# Altium schematic sheet [3] Latch-Connector_Stage.SchDoc
size A2
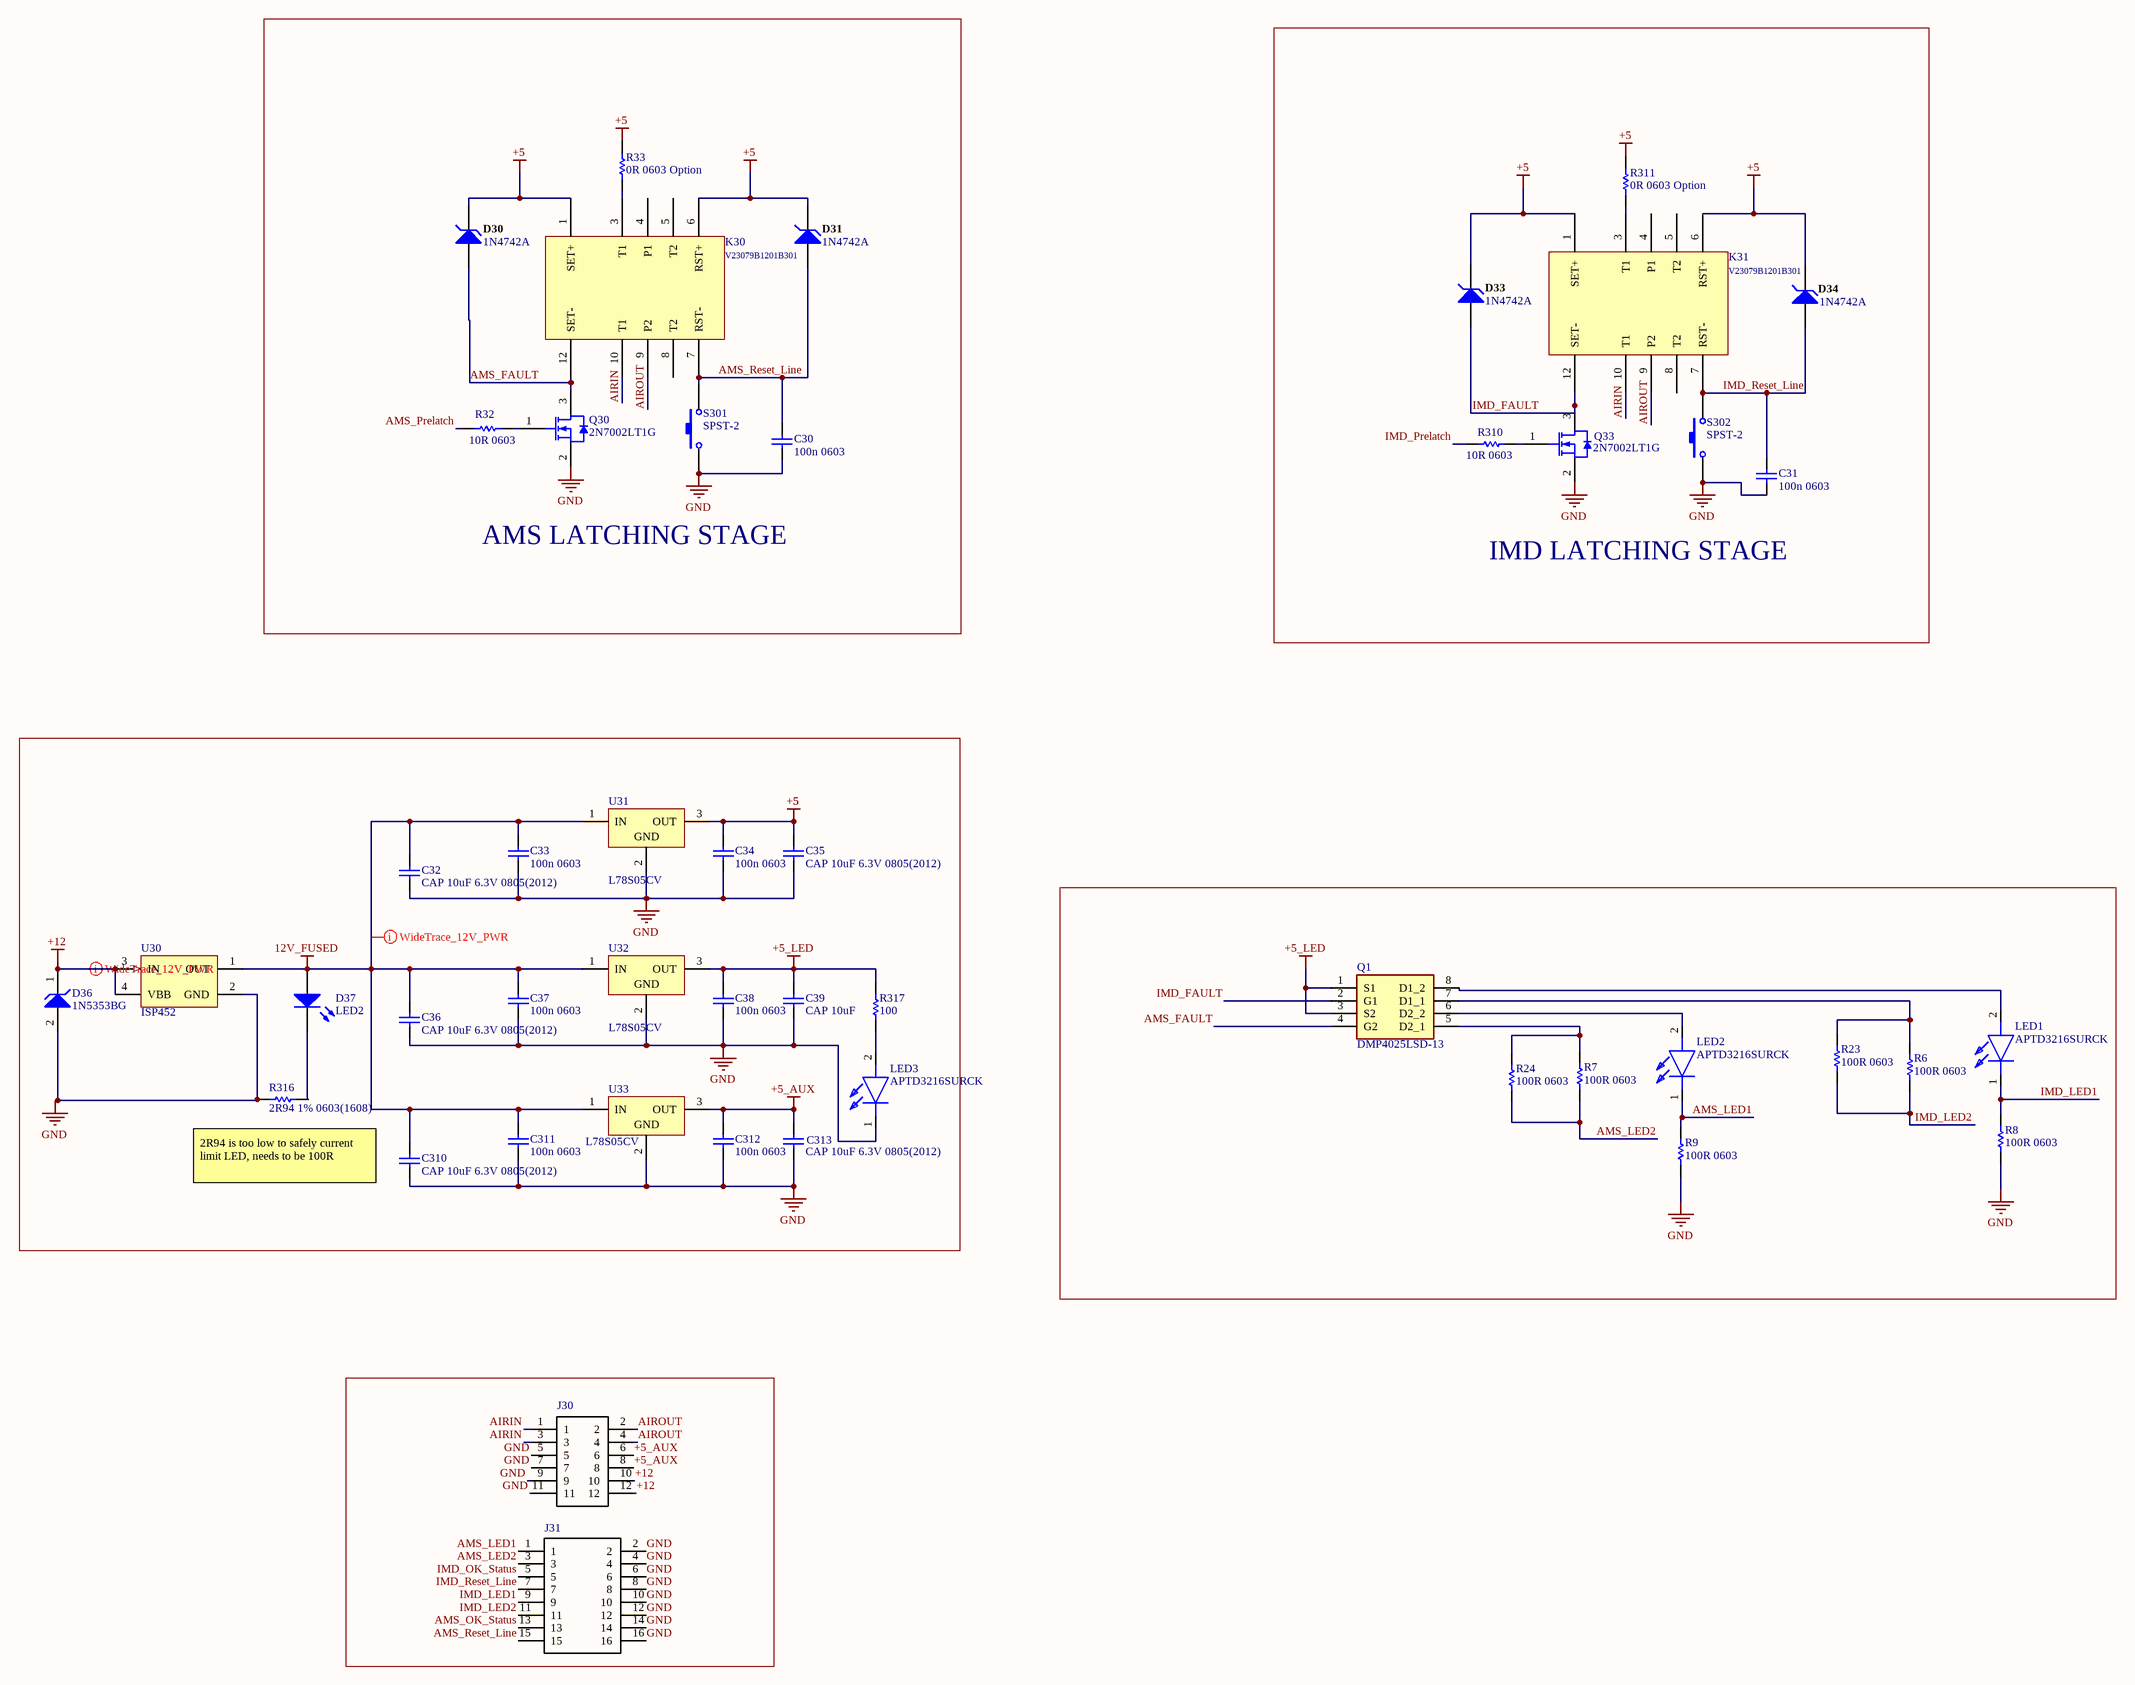
[diagram p0: [3] Latch-Connector_Stage.SchDoc]

## Parts
C30  100n 0603  [CAPC0603(1608)100_M]
C31  100n 0603  [CAPC0603(1608)100_M]
C32  CAP 10uF 6.3V 0805(2012)  [CAPC0805(2012)145_L]
C33  100n 0603  [CAPC0603(1608)100_M]
C34  100n 0603  [CAPC0603(1608)100_M]
C35  CAP 10uF 6.3V 0805(2012)  [CAPC0805(2012)145_L]
C36  CAP 10uF 6.3V 0805(2012)  [CAPC0805(2012)145_L]
C37  100n 0603  [CAPC0603(1608)100_M]
C38  100n 0603  [CAPC0603(1608)100_M]
C39  CAP 10uF  [CAPC0805(2012)145_L]
C310  CAP 10uF 6.3V 0805(2012)  [CAPC0805(2012)145_L]
C311  100n 0603  [CAPC0603(1608)100_M]
C312  100n 0603  [CAPC0603(1608)100_M]
C313  CAP 10uF 6.3V 0805(2012)  [CAPC0805(2012)145_L]
D30  1N4742A  [FAIR-DO-41-2_V]
D31  1N4742A  [FAIR-DO-41-2_V]
D33  1N4742A  [FAIR-DO-41-2_V]
D34  1N4742A  [FAIR-DO-41-2_V]
D36  1N5353BG  [ONSC-SURMETIC40-2-017AA-01]
D37  LED2  [3.2X1.6X1.1]
J30  4-794618-2  [*TE_4-794618-2]  (value not drawn)
J31  4-794618-6  [*TE_4-794618-6]  (value not drawn)
K30  V23079B1201B301  [V23079B1201B301 DPDT]
K31  V23079B1201B301  [V23079B1201B301 DPDT]
LED1  APTD3216SURCK  [LEDC3216X200N]
LED2  APTD3216SURCK  [LEDC3216X200N]
LED3  APTD3216SURCK  [LEDC3216X200N]
Q1  DMP4025LSD-13  [SOIC127P600X175-8N]
Q30  2N7002LT1G  [ONSC-SOT-23-3-318-08_V]
Q33  2N7002LT1G  [ONSC-SOT-23-3-318-08_V]
R6  100R 0603  [RESC1609X50X30ML8T20]
R7  100R 0603  [RESC1609X50X30ML8T20]
R8  100R 0603  [RESC1609X50X30ML8T20]
R9  100R 0603  [RESC1609X50X30ML8T20]
R23  100R 0603  [RESC1609X50X30ML8T20]
R24  100R 0603  [RESC1609X50X30ML8T20]
R32  10R 0603  [CAPC0603(1608)100_M]
R33  0R 0603 Option  [CAPC0603(1608)100_M]
R310  10R 0603  [CAPC0603(1608)100_M]
R311  0R 0603 Option  [CAPC0603(1608)100_M]
R316  2R94 1% 0603(1608)  [RESC0603(1608)_L]
R317  100  [RESC0603(1608)_L]
S301  SPST-2  [SPST-2]
S302  SPST-2  [SPST-2]
U30  ISP452  [INF-SOT223_L]
U31  L78S05CV  [TO220]
U32  L78S05CV  [TO220]
U33  L78S05CV  [TO220]

## Blocks framed on the sheet
AMS LATCHING STAGE: C30 D30 D31 K30 Q30 R32 R33 S301
IMD LATCHING STAGE: C31 D33 D34 K31 Q33 R310 R311 S302

## Nets
12V_FUSED: C32.2 C33.2 C36.2 C37.2 C310.2 C311.2 D37.1(A) U30.1(OUT) U31.1(IN) U32.1(IN) U33.1(IN)
+5: C34.2 C35.2 D30.2(K) D31.2(K) D33.2(K) D34.2(K) K30.1(SET+) K30.6(RST+) K31.1(SET+) K31.6(RST+) R33.2 R311.2 U31.3(OUT)
+5_AUX: C312.2 C313.2 J30.6 J30.8 U33.3(OUT)
+5_LED: C38.2 C39.2 Q1.1(S1) Q1.3(S2) R317.2 U32.3(OUT)
+12: D36.1(K) J30.10 J30.12 U30.3(IN) U30.4(VBB)
GND: C30.1 C31.1 C32.1 C33.1 C34.1 C35.1 C36.1 C37.1 C38.1 C39.1 C310.1 C311.1 C312.1 C313.1 D36.2(A) J30.5 J30.7 J30.9 J30.11 J31.2 J31.4 J31.6 J31.8 J31.10 J31.12 J31.14 J31.16 LED3.1(K) Q30.2(S) Q33.2(S) R8.1 R9.1 R316.1 S301.1 S302.1 U30.2(GND) U31.2(GND) U32.2(GND) U33.2(GND)
AIRIN: J30.1 J30.3 K30.10(T1) K31.10(T1)
AIROUT: J30.2 J30.4 K30.9(P2) K31.9(P2)
AMS_FAULT: D30.1(A) K30.12(SET-) Q1.4(G2) Q30.3(D)
AMS_LED1: J31.1 LED2.1(K) R9.2
AMS_LED2: J31.3 R7.1 R24.1
AMS_OK_Status: J31.13
AMS_Prelatch: R32.1
AMS_Reset_Line: C30.2 D31.1(A) J31.15 K30.7(RST-) S301.2
IMD_FAULT: D33.1(A) K31.12(SET-) Q1.2(G1) Q33.3(D)
IMD_LED1: J31.9 LED1.1(K) R8.2
IMD_LED2: J31.11 R6.1 R23.1
IMD_OK_Status: J31.5
IMD_Prelatch: R310.1
IMD_Reset_Line: C31.2 D34.1(A) J31.7 K31.7(RST-) S302.2
NetD37_2: D37.2(K) R316.2
NetK30_3: K30.3(T1) R33.1
NetK31_3: K31.3(T1) R311.1
NetLED1_2: LED1.2(A) Q1.8(D1_2)
NetLED2_2: LED2.2(A) Q1.6(D2_2)
NetLED3_2: LED3.2(A) R317.1
NetQ1_5: Q1.5(D2_1) R7.2 R24.2
NetQ1_7: Q1.7(D1_1) R6.2 R23.2
NetQ30_1: Q30.1(G) R32.2
NetQ33_1: Q33.1(G) R310.2

Not connected (* = marked no-connect by the designer): K30 4(P1) 5(T2) 8(T2); K31 4(P1) 5(T2) 8(T2)

## Layout directives
rule Width Constraint [Pref Width = 78.74mil    Min Width = 78.74mil    Max Width = 78.74mil]: +12
rule Width Constraint [Pref Width = 150mil    Min Width = 150mil    Max Width = 150mil]: 12V_FUSED

## Notes on the sheet
- 2R94 is too low to safely current limit LED, needs to be 100R

## Library data of the parts
C30 C31 C33 C34 C37 C38 C311 C312 = CAP: Parameter 1: 100n
C32 C35 C36 C39 C310 C313 = CMP-1036-04915-1: CAP 10uF 6.3V ±10% 0805 (2012 Metric) Thickness 1.45mm SMD; Tolerance: Â±10%; Case-EIA: 0805; Case-Metric: 2012; Technology: SMT; Rated Voltage: 6.3 V; Value: 10uF; Max Thickness: 1.45 mm
D30 D31 D33 D34 = CMP-0892-00001-1: Zener Diode, 12V, 1W, 5%, -65 to 200 degC, 2-Pin DO-41, Body 2.72 x 5.2 mm, RoHS; Manufacturer: Fairchild Semiconductor; PD (W): 1; VZ (Min.) (V): 11.4; VZ (Max.) (V): 12.6; ZZ (Max) (ohm): 8; IR (uA): 5; Test Current IZ (mA): 21; PartNumber: 1N4742A; PackageVersion: Rev. 2; DatasheetVersion: Rev. H3; Mounting Technology: Through Hole; Tolerance: 5%; PackageDescription: 2-Pin Axial leaded, Body 2.72 x 5.2 mm, Lead Spread 25.4 mm; ComponentLink1Description: Manufacturer URL; ComponentLink3Description: Package Specification; ComponentLink2Description: Datasheet; ComponentLink2URL: http://www.fairchildsemi.com/ds/1N/1N4744A.pdf; PackageReference: DO-41-2; RoHS: TRUE; Operating and Storage Temperature Range: -65 to 200 degC; ComponentLink3URL: http://www.fairchildsemi.com/dwg/DO/DO41A.pdf; ComponentLink1URL: http://www.fairchildsemi.com/
D36 = CMP-1060-01290-1: 5 W Zener Voltage Regulator, 2-Pin Surmetic(TM) 40, Pb-Free, Bulk Box; Manufacturer: On Semiconductor; P Max (W): 5; VZ Typ (V): 16; Packing: Bulk Box; RoHS: Pb-Free; DatasheetVersion: Rev. 14; PackageDescription: 2-Pin, Axial Lead, Diameter 3.49 mm; ComponentLink3Description: Package Specification; PackageVersion: Rev. O, 09/2005; Mounting Technology: Through Hole; ComponentLink2Description: Datasheet; PartNumber: 1N5353BG; PackageReference: SURMETIC40-2-017AA-01; ComponentLink2URL: http://www.onsemi.cn/pub_link/Collateral/1N5333B-D.PDF; ComponentLink3URL: http://www.onsemi.cn/pub_link/Collateral/017AA.PDF; ComponentLink1Description: Manufacturer URL; ComponentLink1URL: http://www.onsemi.com/
D37 = LED2: Typical RED, GREEN, YELLOW, AMBER GaAs LED; Published: 8-Jun-2000; LatestRevisionDate: 17-Jul-2002; LatestRevisionNote: Re-released for DXP Platform.; PackageVersion: Feb-2002; PackageReference: 3.2X1.6X1.1; Publisher: Altium Limited; PackageDescription: SM LED; 2 Flat Leads
J30 = 4-794618-2: Wire-To-Board Connector, Micro Mate-N-Lok Series, Through Hole, Header, 12, 3 Mm; MF: TE Connectivity; TE_purchase_URL: https://www.te.com/usa-en/product-4-794618-2.html?te_bu=Cor&te_type=disp&te_campaign=seda_glo_cor-seda-global-disp-prtnr-fy19-seda-model-bom-cta_sma-317_1&elqCampaignId=32493; Availability: Unavailable; Package: None; SnapEDA_Link: https://www.snapeda.com/parts/4-794618-2/TE%20Connectivity%20AMP%20Connectors/view-part/?ref=snap; Price: None; EU_RoHS_Compliance: Compliant; MP: 4-794618-2; Value: *
J31 = 4-794618-6: Wire-To-Board Connector, Right Angle, Micro Mate-N-Lok Series, Through Hole, Header, 16, 3 Mm; MF: TE Connectivity; MP: 4-794618-6; TE_purchase_URL: https://www.te.com/usa-en/product-4-794618-6.html?te_bu=Cor&te_type=disp&te_campaign=seda_glo_cor-seda-global-disp-prtnr-fy19-seda-model-bom-cta_sma-317_1&elqCampaignId=32493; Availability: Unavailable; Package: None; Price: None; SnapEDA_Link: https://www.snapeda.com/parts/4-794618-6/TE%20Connectivity%20AMP%20Connectors/view-part/?ref=snap; Value: *
K30 K31 = V23079B1201B301: V23079B1201B301 DPDT
LED1-LED3 = APTD3216SURCK: LED; Manufacturer_Name: Kingbright; Datasheet Link: https://www.mouser.de/ProductDetail/Kingbright/APTD3216SURCK?qs=85uWm5%252BqJhUBFMUPeH99Jg%3D%3D; Height: 2mm; Manufacturer_Part_Number: APTD3216SURCK; Mouser Part Number: 604-APTD-3216SURCK; Mouser Price/Stock: https://www.mouser.co.uk/ProductDetail/Kingbright/APTD3216SURCK?qs=85uWm5%252BqJhUBFMUPeH99Jg%3D%3D; Arrow Part Number: APTD3216SURCK; Arrow Price/Stock: https://www.arrow.com/en/products/aptd3216surck/kingbright
Q1 = DMP4025LSD-13: MOSFET (P-Channel); Manufacturer_Name: Diodes Inc.; Datasheet Link: https://ms.componentsearchengine.com/Datasheets/2/DMP4025LSD-13.pdf; Height: 1.75mm; Manufacturer_Part_Number: DMP4025LSD-13; Mouser Part Number: 621-DMP4025LSD-13; Mouser Price/Stock: https://www.mouser.co.uk/ProductDetail/Diodes-Incorporated/DMP4025LSD-13?qs=gfe7vQ8txpWs%252BZpALpt3%252Bg%3D%3D; Arrow Part Number: DMP4025LSD-13; Arrow Price/Stock: https://www.arrow.com/en/products/dmp4025lsd-13/diodes-incorporated
Q30 Q33 = CMP-1058-00781-1: Small Signal MOSFET, 60 V, 115 mA, N-Channel, 3-Pin SOT-23, Pb-Free, Tape and Reel; Manufacturer: On Semiconductor; Channel Polarity: N Channel; V(BR)DSS Min (V): 60; ID Max (A): 0.115; VGS Max (V): 20; Configuration: Single; VGS(th) Max (V): 2.5; ComponentLink1URL: http://www.onsemi.com/; ComponentLink3Description: Package Specification; ComponentLink3URL: http://www.onsemi.cn/pub_link/Collateral/318-08.PDF; PackageReference: SOT-23-3-318-08; RoHS: Pb-Free; ComponentLink2URL: http://www.onsemi.com/pub_link/Collateral/2N7002L-D.PDF; ComponentLink1Description: Manufacturer URL; Package Type: SOT-23-3; Packing: Tape and Reel; PartNumber: 2N7002LT1G; DatasheetVersion: Rev. 7; Mounting Technology: Surface Mount; ComponentLink2Description: Datasheet; PackageDescription: 3-Pin Small Outline Transistor, Body 2.92 x 1.3 mm, Pitch 0.95 mm; PackageVersion: Rev. AP, 11/2009
R6-R9 R23 R24 = CMP-2000-03824-5: Chip Resistor, 100 Ohm, +/- 1%, 100 mW,-55 to 155 degC, 0603 (1608 Metric), RoHS, Tape and Ree; Manufacturer: Vishay Semiconductor; ComponentLink2URL: http://www.vishay.com/docs/20035/dcrcwe3.pdf; ComponentLink1URL: http://www.vishay.com/; Mounting Technology: Surface Mount; ComponentLink1Description: Manufacturer URL; ComponentLink2Description: Datasheet; PackageDescription: 2-Pin Surface Mount Device, Body 1.575 x 0.85 mm; PackageReference: 0603; DatasheetVersion: 06/2012
R32 R310 = Res1: Resistor; Published: 8-Jun-2000; LatestRevisionDate: 17-Jul-2002; LatestRevisionNote: Re-released for DXP Platform.; PackageReference: AXIAL-0.3; Publisher: Altium Limited; PackageDescription: Axial Device, Thru-Hole; 2 Leads; 0.3 in Pin Spacing
  R32: Value: 10R
  R310: Value: 10R 0603
R33 R311 = RES: Value: 100k
R316 R317 = CMP-1012-00222-1: 2R94 0.1W 1% 0603 (1608 Metric)  SMD; Case-Metric: 1608; Case-EIA: 0603; Value: 2.94 Ohm; Power: 0.1 W; Technology: SMT; Tolerance: 1 %
S301 S302 = SW-PB: Switch; Published: 24-Mar-1999; LatestRevisionDate: 17-Jul-2002; LatestRevisionNote: Re-released for DXP Platform.; PackageReference: SPST-2; Publisher: Altium Limited; PackageDescription: Switch; 2 Leads
U30 = CMP-1095-00141-1: Smart Power High-Side-Switch for Industrial Applications, 5 to 34 V Operating, -30 to 85 degC, SOT223, Reel, Green; Manufacturer: Infineon; Green: TRUE; IL (nom)min - all channels active: 0.7Â A; Channels: 1; IL (nom)min - one channel active: 0.8Â A; Operating Voltage Range (min): 5 V; Ptot (max): 1.8Â W; toff (max): 150 us; RON (max) @ Tj max: 400 mOhm; ton (max): 100 us; IL (SCp): 1.5Â A; Operating Voltage Range (max): 34 V; RON @ 25 degC: 200 mOhm (max); ComponentLink3Description: Package Specification; Mounting Technology: Surface Mount; ComponentLink2Description: Datasheet; PartNumber: ISP452; Packing: Reel; Load Current (typ): 0.7Â A; PackageDescription: 4-Pin Small Outline Transistor Package, 6.5 x 3.5 mm Body, 2.3 mm Pitch; ComponentLink3URL: http://www.infineon.com/dgdl/SOT223-Package_Overview.pdf?folderId=db3a30431936bc4b0119530470b03c3d&fileId=db3a30431936bc4b0119531d40b93c5c; ComponentLink1Description: Manufacturer URL; ComponentLink1URL: http://www.infineon.com/; ComponentLink2URL: http://www.infineon.com/dgdl/ISP452_20060301.pdf?folderId=db3a304412b407950112b408e8c90004&fileId=db3a304412b407950112b42957ef40c3; PackageReference: SOT223; IL (SC): 1.5Â A; PackageVersion: Apr-08
U31-U33 = CMP-0244-00436-1: 2A Positive Voltage Regulator, 5V, 3-Pin TO-220; PackageVersion: ver3.0; ComponentLink2URL: http://www.st.com/internet/com/TECHNICAL_RESOURCES/TECHNICAL_LITERATURE/DATASHEET/CD00000449.pdf; ComponentLink1Description: Manufacturer URL; DatasheetVersion: 1/03/2010; PackageDescription: TO, Thru-Hole, Vertical, Heatsink Mounted; 3 In-Line Leads; Pitch 2.54 mm; ComponentLink2Description: Datasheet; ComponentLink1URL: http://www.st.com; ComponentLink3Description: Package Specification; PackageReference: TO220; ComponentLink3URL: http://www.st.com/internet/com/TECHNICAL_RESOURCES/TECHNICAL_LITERATURE/PACKAGE_INFORMATION/CD00004649.pdf